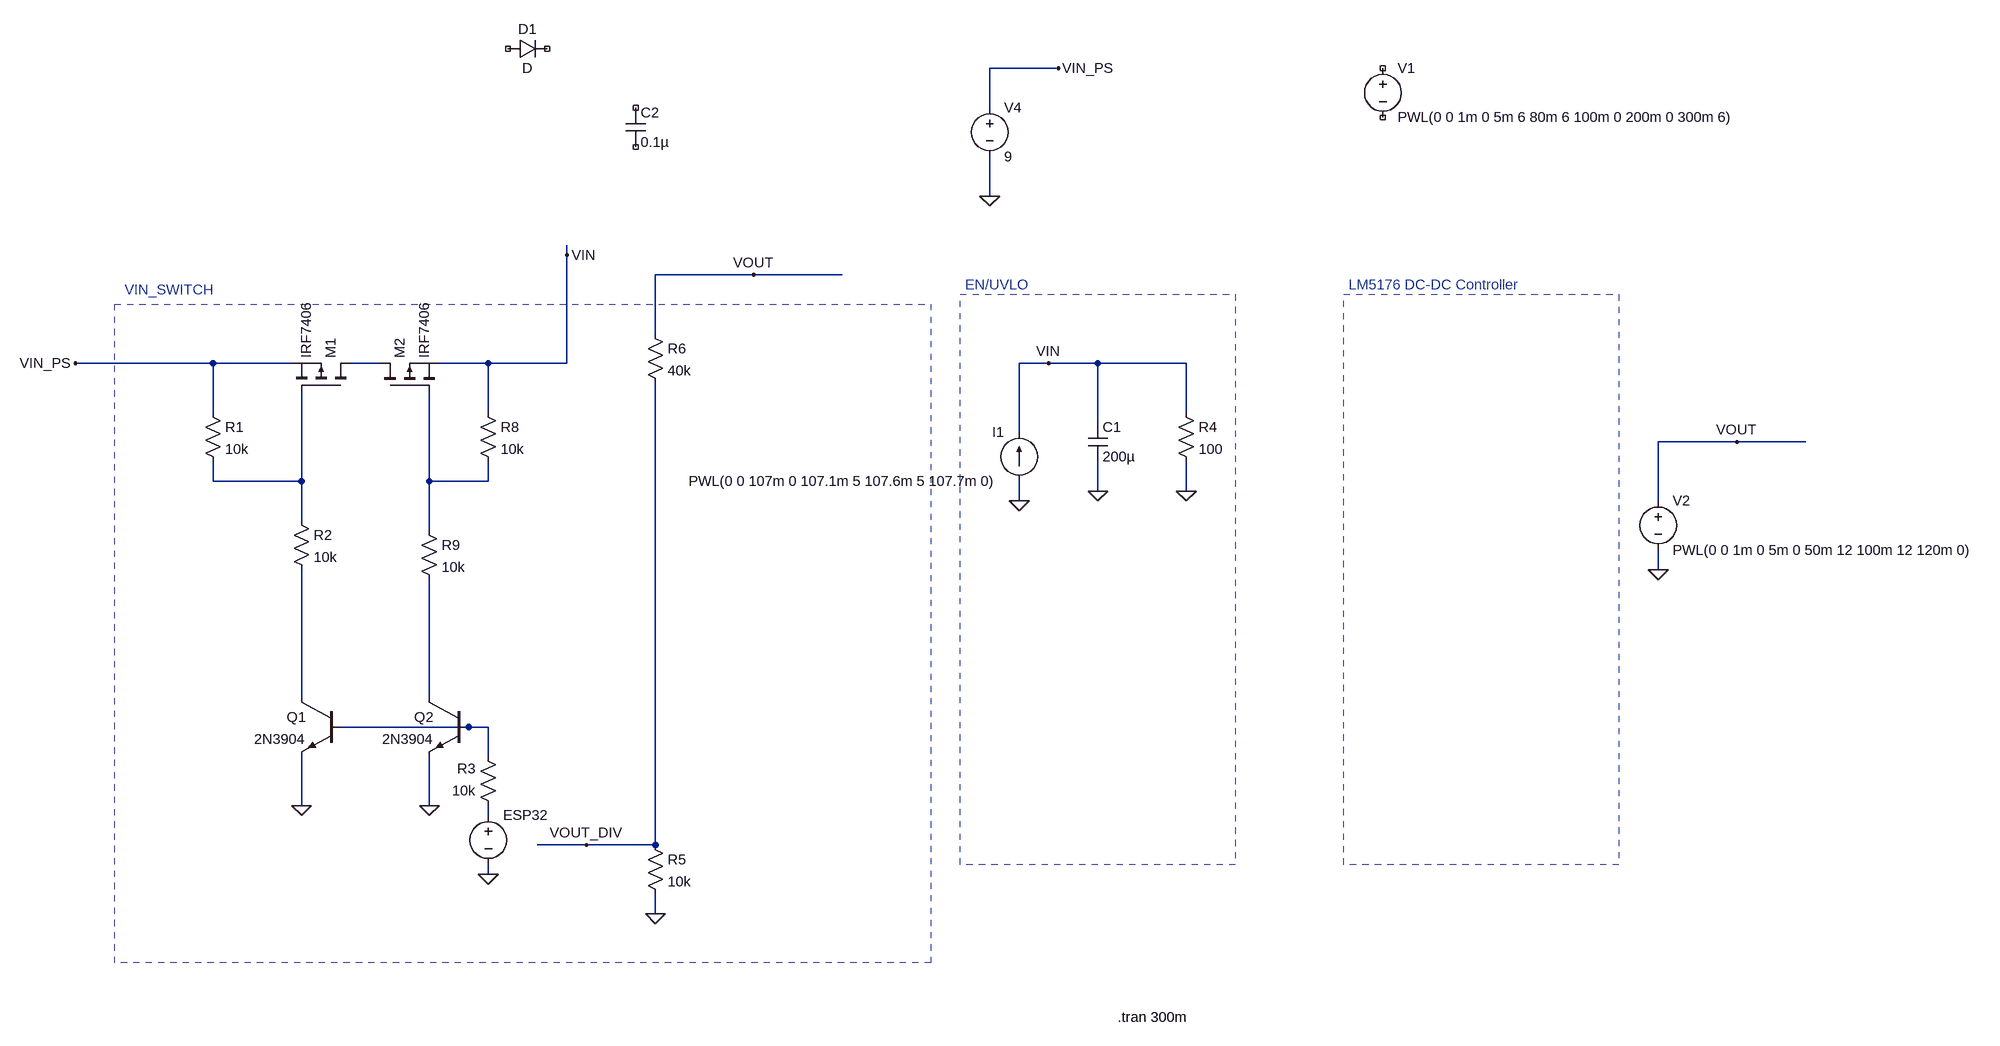
[diagram p0: schematic vin_rework_v1.asc]
vin_rework_v1.asc, the LTspice schematic file:
Version 4
SHEET 1 2756 1284
WIRE 1136 -896 1024 -896
WIRE 1024 -832 1024 -896
WIRE 1024 -688 1024 -752
WIRE 336 -592 336 -608
WIRE 640 -560 480 -560
WIRE 784 -560 640 -560
WIRE 480 -464 480 -560
WIRE -240 -416 -464 -416
WIRE -112 -416 -240 -416
WIRE 32 -416 -16 -416
WIRE 208 -416 128 -416
WIRE 336 -416 336 -592
WIRE 336 -416 208 -416
WIRE 1120 -416 1072 -416
WIRE 1200 -416 1120 -416
WIRE 1344 -416 1200 -416
WIRE -240 -336 -240 -416
WIRE 208 -336 208 -416
WIRE 1344 -336 1344 -416
WIRE 1200 -320 1200 -416
WIRE 1072 -304 1072 -416
WIRE 2240 -288 2112 -288
WIRE 2352 -288 2240 -288
WIRE -240 -224 -240 -256
WIRE -96 -224 -96 -368
WIRE -96 -224 -240 -224
WIRE 112 -224 112 -368
WIRE 208 -224 208 -256
WIRE 208 -224 112 -224
WIRE 1200 -208 1200 -256
WIRE 1344 -208 1344 -256
WIRE 1072 -192 1072 -224
WIRE 2112 -192 2112 -288
WIRE -96 -160 -96 -224
WIRE 112 -144 112 -224
WIRE 2112 -80 2112 -112
WIRE -96 128 -96 -80
WIRE 112 128 112 -64
WIRE 176 176 -32 176
WIRE 208 176 176 176
WIRE 208 224 208 176
WIRE -96 304 -96 224
WIRE 112 304 112 224
WIRE 208 320 208 304
WIRE 368 368 288 368
WIRE 480 368 480 -384
WIRE 480 368 368 368
WIRE 208 416 208 400
WIRE 480 480 480 448
FLAG 480 480 0
FLAG -96 304 0
FLAG 1024 -688 0
FLAG 2112 -80 0
FLAG 1136 -896 VIN_PS
FLAG 1120 -416 VIN
FLAG 2240 -288 VOUT
FLAG -464 -416 VIN_PS
FLAG 640 -560 VOUT
FLAG 336 -592 VIN
FLAG 1200 -208 0
FLAG 1344 -208 0
FLAG 208 416 0
FLAG 368 368 VOUT_DIV
FLAG 1072 -192 0
FLAG 112 304 0
SYMBOL npn -32 128 M0
SYMATTR InstName Q1
SYMATTR Value 2N3904
SYMBOL res 464 -480 R0
SYMATTR InstName R6
SYMATTR Value 40k
SYMBOL res 464 352 R0
SYMATTR InstName R5
SYMATTR Value 10k
SYMBOL voltage 1664 -912 R0
WINDOW 123 0 0 Left 0
WINDOW 39 0 0 Left 0
SYMATTR InstName V1
SYMATTR Value PWL(0 0 1m 0 5m 6 80m 6 100m 0 200m 0 300m 6)
SYMBOL voltage 2112 -208 R0
WINDOW 123 0 0 Left 0
WINDOW 39 0 0 Left 0
SYMATTR InstName V2
SYMATTR Value PWL(0 0 1m 0 5m 0 50m 12 100m 12 120m 0)
SYMBOL pmos -16 -368 M270
SYMATTR InstName M1
SYMATTR Value IRF7406
SYMBOL res -256 -352 R0
SYMATTR InstName R1
SYMATTR Value 10k
SYMBOL res -112 -176 R0
SYMATTR InstName R2
SYMATTR Value 10k
SYMBOL res 224 320 R180
WINDOW 0 36 76 Left 2
WINDOW 3 36 40 Left 2
SYMATTR InstName R3
SYMATTR Value 10k
SYMBOL cap 1184 -320 R0
SYMATTR InstName C1
SYMATTR Value 200µ
SYMBOL res 1328 -352 R0
SYMATTR InstName R4
SYMATTR Value 100
SYMBOL voltage 208 304 R0
WINDOW 3 24 96 Invisible 2
WINDOW 123 0 0 Left 0
WINDOW 39 0 0 Left 0
SYMATTR InstName ESP32
SYMATTR Value PWL(0 0 105m 0 105.1m 3.3 105.2m 3.3 105.3m 0)
SYMBOL voltage 1024 -848 R0
WINDOW 123 0 0 Left 0
WINDOW 39 0 0 Left 0
SYMATTR InstName V4
SYMATTR Value 9
SYMBOL current 1072 -224 R180
WINDOW 0 24 80 Left 2
WINDOW 3 24 0 Left 2
WINDOW 123 0 0 Left 0
WINDOW 39 0 0 Left 0
SYMATTR InstName I1
SYMATTR Value PWL(0 0 107m 0 107.1m 5 107.6m 5 107.7m 0)
SYMBOL pmos 32 -368 R270
SYMATTR InstName M2
SYMATTR Value IRF7406
SYMBOL res 192 -352 R0
SYMATTR InstName R8
SYMATTR Value 10k
SYMBOL res 96 -160 R0
SYMATTR InstName R9
SYMATTR Value 10k
SYMBOL npn 176 128 M0
SYMATTR InstName Q2
SYMATTR Value 2N3904
SYMBOL diode 240 -912 R270
WINDOW 0 32 32 VTop 2
WINDOW 3 0 32 VBottom 2
SYMATTR InstName D1
SYMBOL cap 432 -832 R0
SYMATTR InstName C2
SYMATTR Value 0.1µ
TEXT 1232 648 Left 2 !.tran 300m
TEXT 984 -544 Left 2 ;EN/UVLO
TEXT 1608 -544 Left 2 ;LM5176 DC-DC Controller
TEXT -384 -536 Left 2 ;VIN_SWITCH
RECTANGLE Normal 1424 400 976 -528 2
RECTANGLE Normal 2048 400 1600 -528 2
RECTANGLE Normal 928 560 -400 -512 2

The netlist it stands for:
* vin_rework_v1.asc
Q1 N004 N006 0 0 2N3904
R6 VOUT VOUT_DIV 40k
R5 VOUT_DIV 0 10k
V1 NC_01 NC_02 PWL(0 0 1m 0 5m 6 80m 6 100m 0 200m 0 300m 6)
V2 VOUT 0 PWL(0 0 1m 0 5m 0 50m 12 100m 12 120m 0)
M1 N001 N002 VIN_PS VIN_PS IRF7406
R1 VIN_PS N002 10k
R2 N002 N004 10k
R3 N007 N006 10k
C1 VIN 0 200µ
R4 VIN 0 100
V§ESP32 N007 0 PWL(0 0 105m 0 105.1m 3.3 105.2m 3.3 105.3m 0)
V4 VIN_PS 0 9
I1 0 VIN PWL(0 0 107m 0 107.1m 5 107.6m 5 107.7m 0)
M2 N001 N003 VIN VIN IRF7406
R8 VIN N003 10k
R9 N003 N005 10k
Q2 N005 N006 0 0 2N3904
D1 NC_03 NC_04 D
C2 NC_05 NC_06 0.1µ
.model D D
.lib standard.dio
.model NPN NPN
.model PNP PNP
.lib standard.bjt
.model NMOS NMOS
.model PMOS PMOS
.lib standard.mos
.tran 300m
* EN/UVLO
* LM5176 DC-DC Controller
* VIN_SWITCH
.backanno
.end